# EAGLE schematic tiny13devboard (EAGLE 6.4)
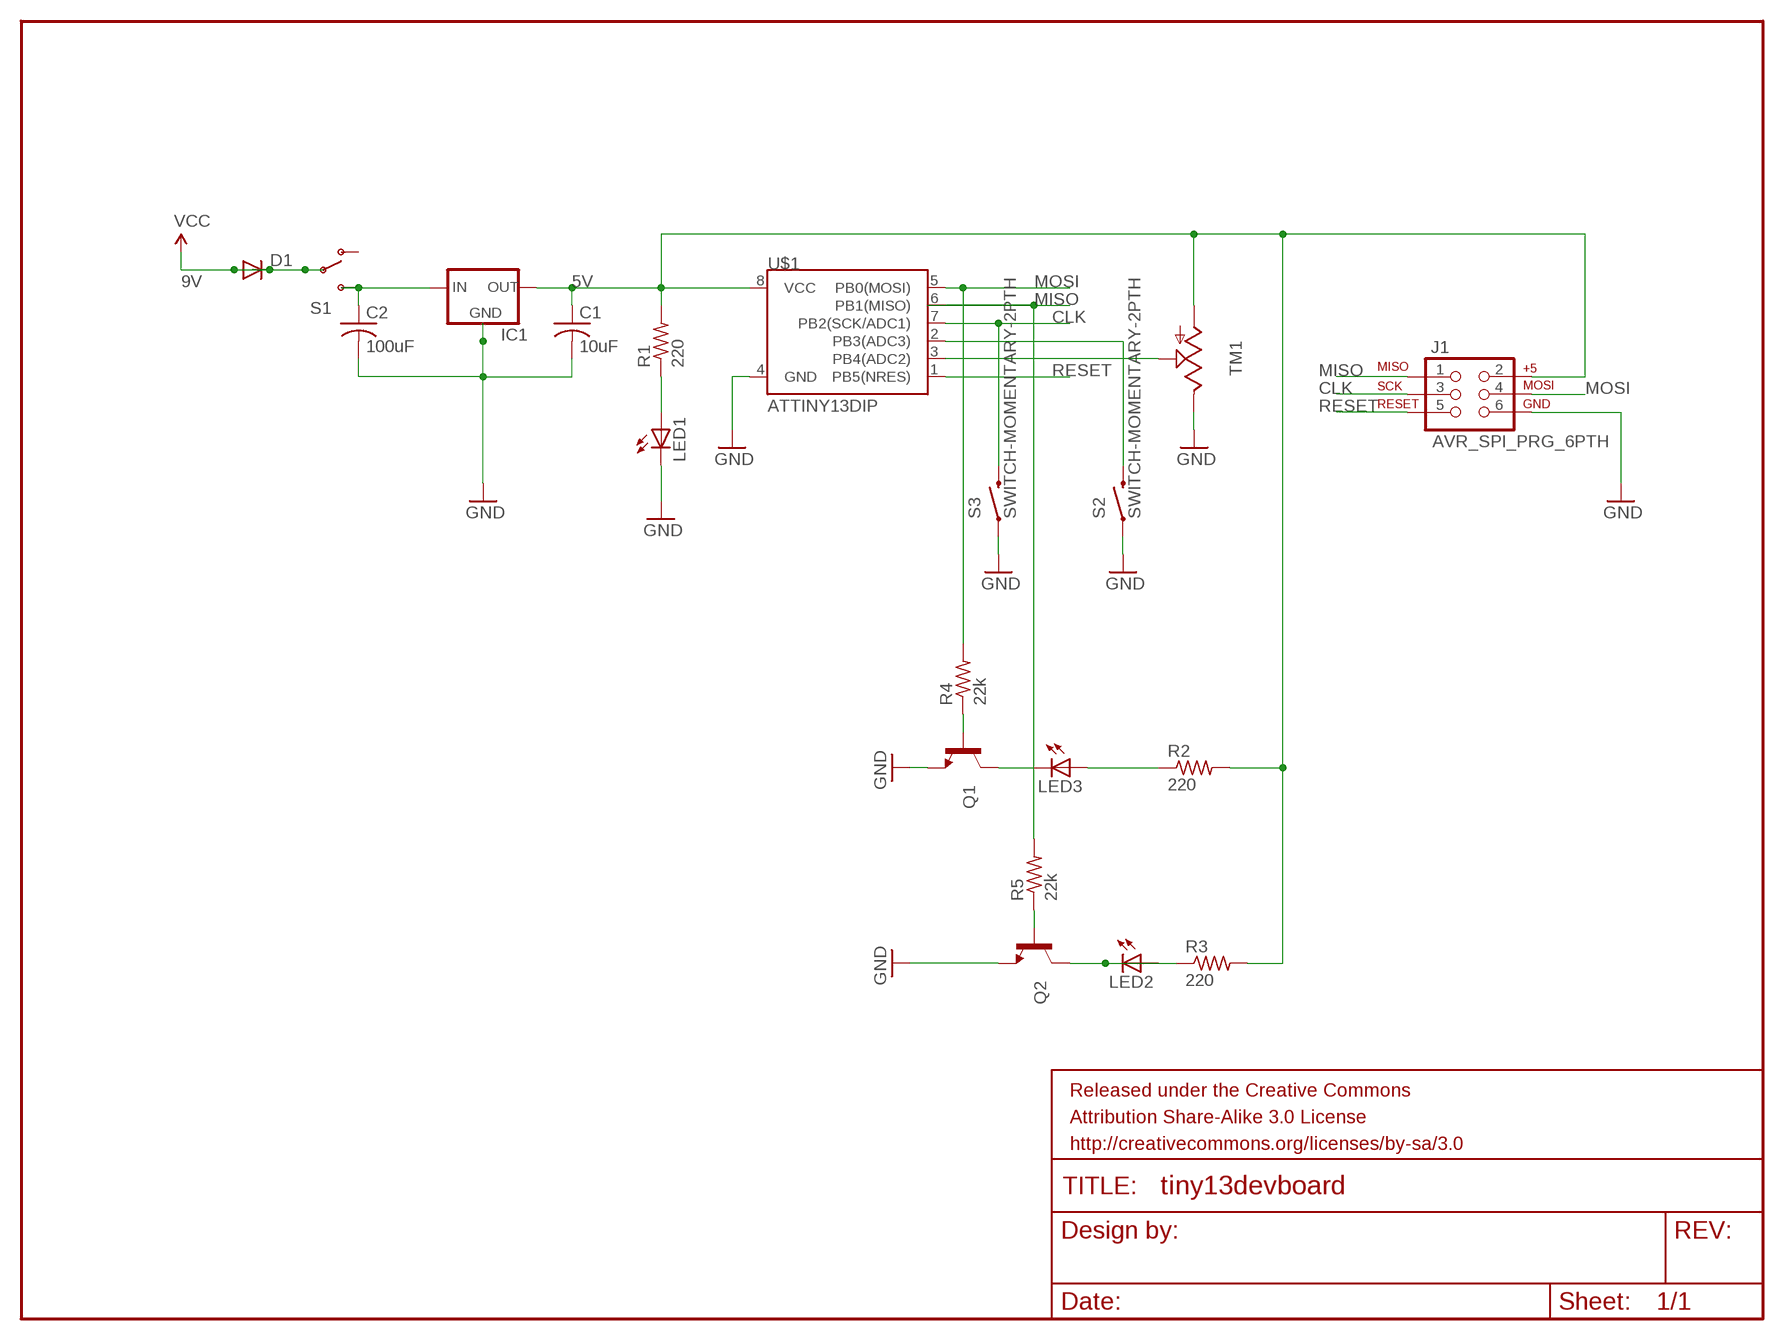
[diagram p0: schematic, sheet 1]

## Parts
C1  10uF  C-US050-025X075  [C050-025X075]
C2  100uF  C-US050-025X075  [C050-025X075]
D1  DIODEPTH  [DIODE-1N4001]
FRAME1  FRAME-LETTER  [CREATIVE_COMMONS]
IC1  V_REG_78XX-TO-220  [TO-220-ALT]
J1  AVR_SPI_PRG_6PTH  [2X3]
LED1  LED5MM  [LED5MM]
LED2  LED5MM  [LED5MM]
LED3  LED5MM  [LED5MM]
Q1  TRANSISTOR_NPNTO92  [TO-92]
Q2  TRANSISTOR_NPNTO92  [TO-92]
R1  220  R-US_0207/10  [0207/10]
R2  220  R-US_0207/10  [0207/10]
R3  220  R-US_0207/10  [0207/10]
R4  22k  R-US_0207/10  [0207/10]
R5  22k  R-US_0207/10  [0207/10]
S1  SWITCH-SPDTPTH  [SWITCH-SPDT]
S2  SWITCH-MOMENTARY-2PTH  [TACTILE-PTH]
S3  SWITCH-MOMENTARY-2PTH  [TACTILE-PTH]
TM1  TRIM  [6MM]
U$1  ATTINY13DIP  [DIP08]

## Nets
5V: C1.1 IC1.OUT J1.2 R1.2 R2.2 R3.2 TM1.A U$1.8(VCC)
9V: D1.A D1.C S1.2(P) ; supply symbol labelled VCC
CLK: J1.3 S3.3 U$1.7(PB2(SCK/ADC1))
GND: C1.2 C2.2 IC1.GND J1.6 LED1.K(C) Q1.1(E) Q2.1(E) S2.1 S3.1 TM1.E U$1.4(GND)
MISO: J1.1 R5.2 U$1.6(PB1(MISO))
MOSI: J1.4 R4.2 U$1.5(PB0(MOSI))
N$1: C2.1 IC1.IN S1.3(S)
N$2: S2.3 U$1.2(PB3(ADC3))
N$3: LED1.A R1.1
N$5: Q1.2(B) R4.1
N$7: LED3.K(C) Q1.3(C)
N$8: LED3.A R2.1
N$10: Q2.2(B) R5.1
N$11: LED2.A LED2.K(C) Q2.3(C) R3.1
N$12: TM1.S U$1.3(PB4(ADC2))
RESET: J1.5 U$1.1(PB5(NRES))
Unconnected: S1.1(O)

## Library data of the parts
C1 C2 = adafruit:C-US: CAPACITOR, American symbol
D1 = SparkFun-DiscreteSemi:DIODE: Diode These are standard reverse protection diodes and small signal diodes. SMA package can handle up to about 1A. SOD-323 can handle about 200mA. What the SOD-323 package when ordering, there are some mfgs out there that are 5-pin packages.
FRAME1 = SparkFun-Aesthetics:FRAME-LETTER: Schematic Frame Standard 8.5x11 US Letter frame
IC1 = SparkFun-PowerIC:V_REG_78XX: Voltage Regulator Standard 7805 5V regulator. IGO (Input Ground Output). Spark Fun Electronics SKU : COM-00107
J1 = SparkFun-Connectors:AVR_SPI_PRG_6: AVR ISP 6 Pin This is the reduced ISP connector for AVR programming. Common on Arduino. This footprint will take up less PCB space and can be used with a 10-pin to 6-pin adapter such as SKU: BOB-08508
LED1-LED3 = adafruit:LED: LED OSRAM: - CHIPLED LG R971, LG N971, LY N971, LG Q971, LY Q971, LO R971, LY R971 LH N974, LH R974 LS Q976, LO Q976, LY Q976 LO Q996 - Hyper CHIPLED LW Q18S LB Q993, LB Q99A, LB R99A - SideLED LS A670, LO A670, LY A670, LG A670, LP A670 LB A673, LV A673, LT A673, LW A673 LH A674 LY A675 LS A676, LA A676, LO A676, LY A676, LW A676 LS A679, LY A679, LG A679 - Hyper Micro SIDELED® LS Y876, LA Y876, LO Y876, LY Y876 LT Y87S - SmartLED LW L88C, LW L88S LB L89C, LB L89S, LG L890 LS L89K, LO L89K, LY L89K LS L896, LA L896, LO L896, LY L896 - TOPLED LS T670, LO T670, LY T670, LG T670, LP T670 LSG T670, LSP T670, LSY T670, LOP T670, LYG T670 LG T671, LOG T671, LSG T671 LB T673, LV T673, LT T673, LW T673 LH T674 LS T676, LA T676, LO T676, LY T676, LB T676, LH T676, LSB T676, LW T676 LB T67C, LV T67C, LT T67C, LS T67K, LO T67K, LY T67K, LW E67C LS E67B, LA E67B, LO E67B, LY E67B, LB E67C, LV E67C, LT E67C LW T67C LS T679, LY T679, LG T679 LS T770, LO T770, LY T770, LG T770, LP T770 LB T773, LV T773, LT T773, LW T773 LH T774 LS E675, LA E675, LY E675, LS T675 LS T776, LA T776, LO T776, LY T776, LB T776 LHGB T686 LT T68C, LB T68C - Hyper Mini TOPLED® LB M676 - Mini TOPLED Santana® LG M470 LS M47K, LO M47K, LY M47K Source: http://www.osram.convergy.de/
Q1 Q2 = SparkFun-DiscreteSemi:TRANSISTOR_NPN: Generic NPN BJT. MMBT2222 is the common NPN we use. Double check against datasheet- not all devices are the same!
R1-R5 = adafruit:R-US_: RESISTOR, American symbol
S1 = SparkFun-Electromechanical:SWITCH-SPDT: SPDT Switch Simple slide switch, Spark Fun Electronics SKU : COM-00102 DPDT SMT slide switch, AYZ0202, SWCH-08179
S2 S3 = SparkFun-Electromechanical:SWITCH-MOMENTARY-2: Various NO switches- pushbuttons, reed, etc
TM1 = adafruit:TRIM
U$1 = SparkFun-DigitalIC:ATTINY13: Atmel 8-pin 1kB flash uC